# EAGLE design Power_POE (EAGLE 9.6.2)
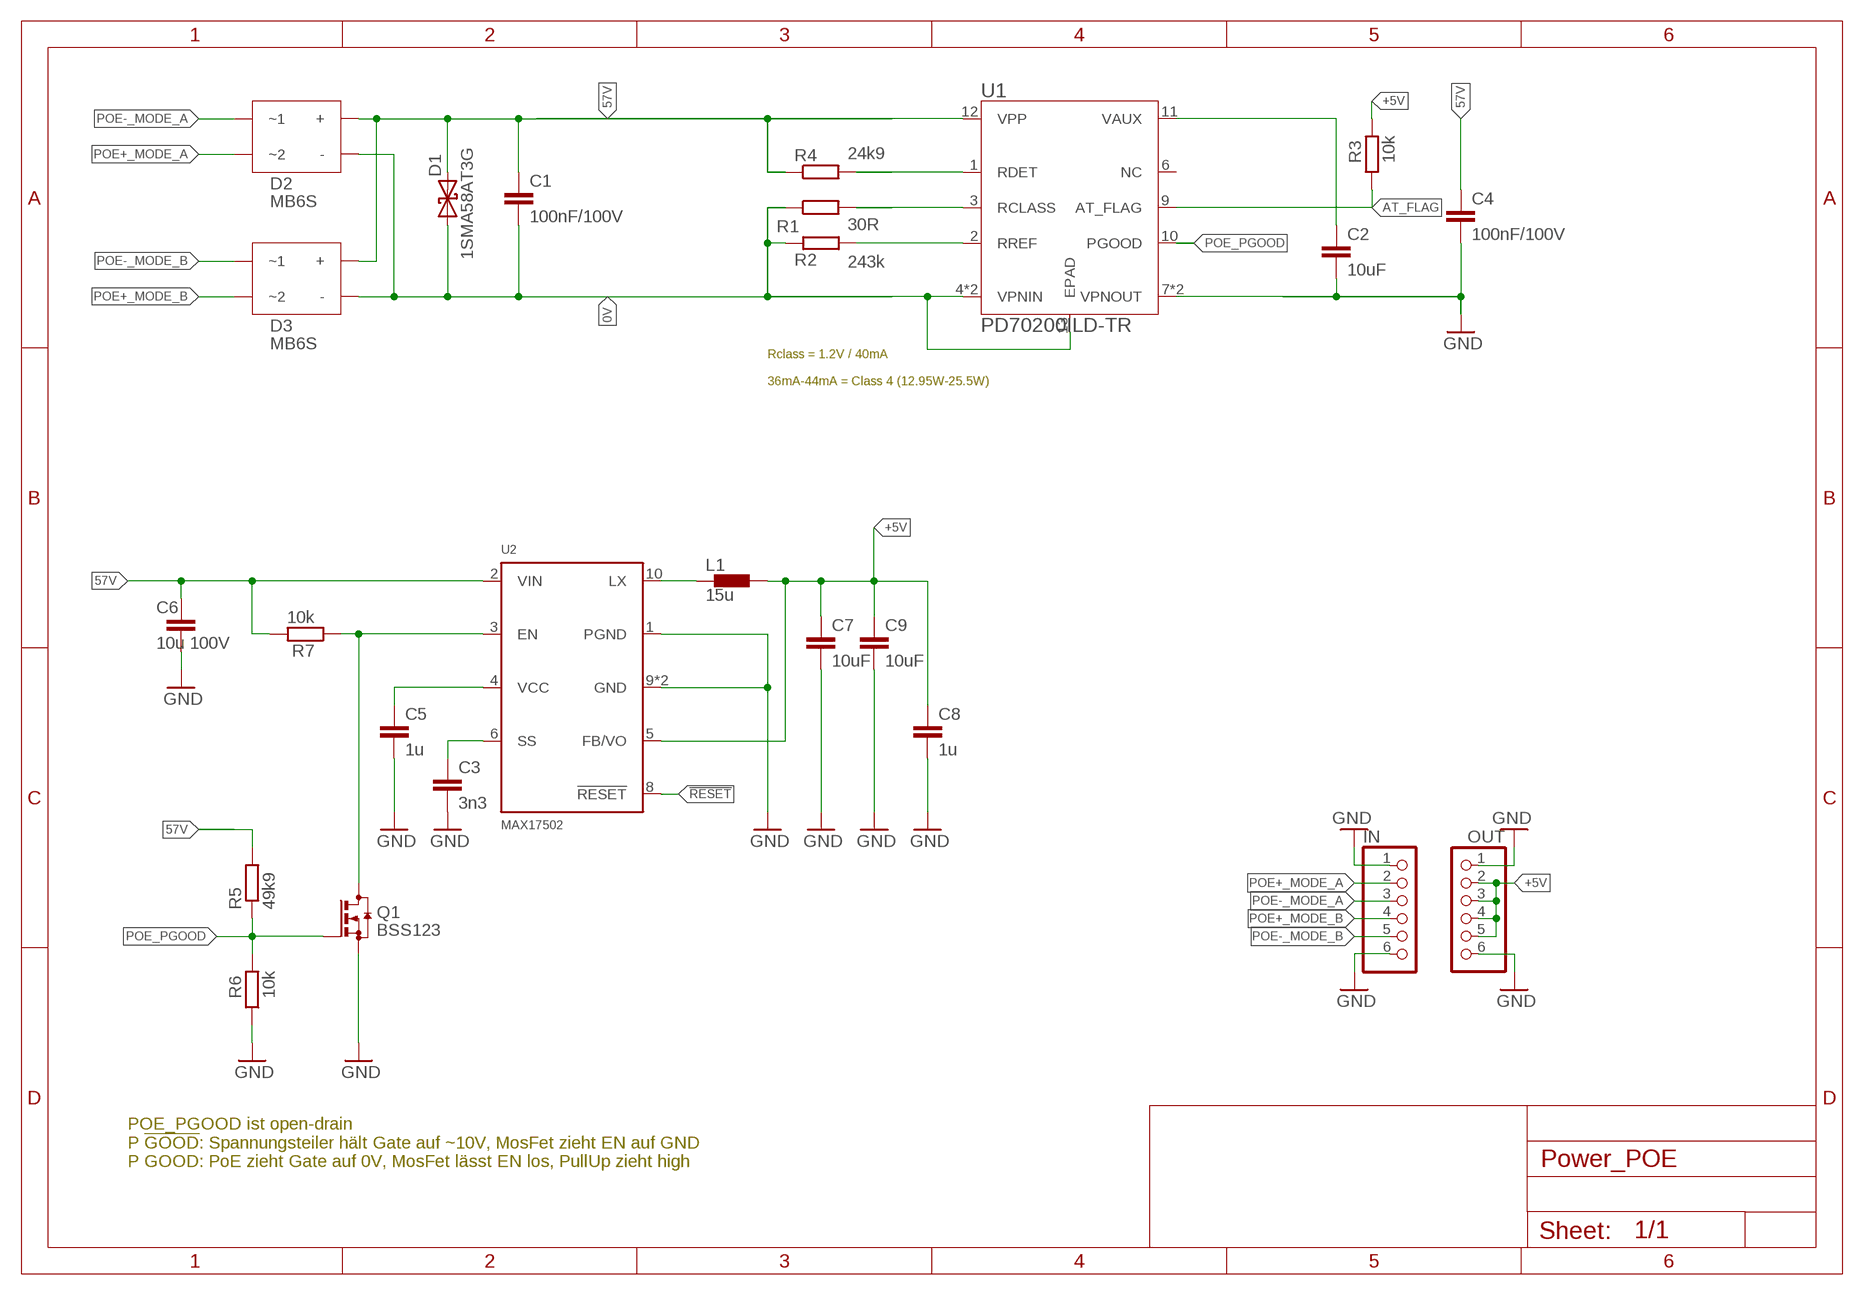
[diagram p0: schematic, sheet 1]

## Parts
C1  100nF/100V  C-EUC0603  [C0603]
C2  10uF  C-EUC0805  [C0805]
C3  3n3  C-EUC0603  [C0603]
C4  100nF/100V  C-EUC0603  [C0603]
C5  1u  C-EUC0805  [C0805]
C6  10u 100V  C-EUC1210K  [C1210K]
C7  10uF  C-EUC0805  [C0805]
C8  1u  C-EUC0805  [C0805]
C9  10uF  C-EUC0805  [C0805]
D1  1SMA58AT3G  SMAJ_DIODE  [DO214AC]
D2  MB6S  [SOIC4W]
D3  MB6S  [SOIC4W]
IN  PINHD-1X06_2.00  [1X06M]
L1  15u  INDUCTOR_LPS6235  [LPS6235]
OUT  PINHD-1X06_2.00  [1X06M]
Q1  BSS123  [SOT23]
R1  30R  R-EU_R0603  [R0603]
R2  243k  R-EU_R0603  [R0603]
R3  10k  R-EU_R0603  [R0603]
R4  24k9  R-EU_R0603  [R0603]
R5  49k9  R-EU_R0603  [R0603]
R6  10k  R-EU_R0603  [R0603]
R7  10k  R-EU_R0603  [R0603]
U1  PD70200ILD-TR  [DFN12_4X3_MIS]
U2  MAX17502  [TDFN10-3X2MM]

## Nets
0V: C1.2 D1.A D2.P$2(-) D3.P$2(-) R1.1 R2.1 U1.4(VPNIN) U1.5(VPNIN) U1.13(EPAD)
57V: C1.1 C4.1 C6.1 D1.C D2.P$1(+) D3.P$1(+) R4.1 R5.2 R7.2 U1.12(VPP) U2.2(VIN)
!RESET: U2.8(!RESET)
+5V: C7.1 C8.1 C9.1 L1.2 OUT.2 OUT.3 OUT.4 OUT.5 R3.2 U2.5(FB/VO)
AT_FLAG: R3.1 U1.9(AT_FLAG)
GND: C2.2 C3.2 C4.2 C5.2 C6.2 C7.2 C8.2 C9.2 IN.1 IN.6 OUT.1 OUT.6 Q1.2(S) R6.1 U1.7(VPNOUT) U1.8(VPNOUT) U2.1(PGND) U2.9(GND) U2.TH(GND)
N$00003: R4.2 U1.1(RDET)
N$00004: R1.2 U1.3(RCLASS)
N$00006: C5.1 U2.4(VCC)
N$00009: L1.1 U2.10(LX)
N$00011: R2.2 U1.2(RREF)
N$00020: C2.1 U1.11(VAUX)
N$00036: Q1.3(D) R7.1 U2.3(EN)
N$00043: C3.1 U2.6(SS)
POE+_MODE_A: D2.P$4(~2) IN.2
POE+_MODE_B: D3.P$4(~2) IN.4
POE-_MODE_A: D2.P$3(~1) IN.3
POE-_MODE_B: D3.P$3(~1) IN.5
POE_PGOOD: Q1.1(G) R5.1 R6.2 U1.10(PGOOD)
Unconnected: U1.6(NC)

## Notes on the sheet
- Rclass = 1.2V / 40mA
  
  36mA-44mA = Class 4 (12.95W-25.5W)
- POE_PGOOD ist open-drain
  P !GOOD!: Spannungsteiler hält Gate auf ~10V, MosFet zieht EN auf GND
  P GOOD: PoE zieht Gate auf 0V, MosFet lässt EN los, PullUp zieht high

## Library data of the parts
C1 C4 = rcl:C-EU: CAPACITOR, European symbol; DIGIKEY: 1276-6807-1-ND; LCSC: C15725; MBM: 1; PREIS: 0,09
C2 C7 C9 = rcl:C-EU: CAPACITOR, European symbol; LCSC: C3039694; PARAMETER: 10µF 25V X7R; SPICEPREFIX: C
C3 = rcl:C-EU: CAPACITOR, European symbol; BUERKLIN: 53D1704; LCSC: C1613; MBM: 10; PREIS: 0,083
C5 C8 = rcl:C-EU: CAPACITOR, European symbol; BUERKLIN: 53D2422; LAGERORT: 21/10; LCSC: C116352; MBM: 10; PREIS: 0,0952
C6 = rcl:C-EU: CAPACITOR, European symbol; DIGIKEY: 1276-CL32Y106KCVZNWECT-ND; LCSC: C576517; SPICEPREFIX: C
D1 = mh_fpga_anschlussplatine_v2:SMAJ_DIODE; DIGIKEY: SMAJ58ALFCT-ND; LCSC: C151246; MBM: 1; MF: Littlefuse; MPN: SMAJ58A; PARAMETER: 58V VRM, 64.4V VBR_MIN, 93.6V VBR_MAX; PREIS: 0,33
D2 D3 = MB6S:MB6S; LCSC: C83867; MOUSER: 512-MB6S
IN OUT = pinhead-2:PINHD-1X06: PIN HEADER
L1 = Coilcraft:INDUCTOR; DIGIKEY: 4652-LPS6235-153MRC-ND; LCSC: C3033031; MPN: LPS6235-153MRC; PREIS: 1,4
Q1 = transistor-small-signal:BSS123: N-CHANNEL MOS FET; DIGIKEY: 1727-4246-1-ND; LCSC: C79015
R1 = rcl:R-EU_: RESISTOR, European symbol; DIGIKEY: 738-RMCF0603FT30R0CT-ND; LCSC: C144119; SPICEPREFIX: R
R2 = rcl:R-EU_: RESISTOR, European symbol; DIGIKEY: RMCF0603FT243KCT-ND; LCSC: C23351; SPICEPREFIX: R
R3 R6 R7 = rcl:R-EU_: RESISTOR, European symbol; BUERKLIN: 26 E 816; LAGERORT: 45/08; LCSC: C25804; MBM: 10; PREIS: 0,03
R4 = rcl:R-EU_: RESISTOR, European symbol; FARNELL: 2447309; LCSC: C137761; SPICEPREFIX: R
R5 = rcl:R-EU_: RESISTOR, European symbol; DIGIKEY: RMCF0603FT49K9CT-ND; LCSC: C23184; SPICEPREFIX: R
U1 = TI_TPS2379:PD70200ILD-TR: IEEE® 802.3af/at PD Front End IC; DIGIKEY: PD70200ILDCT-ND; LCSC: C3187754
U2 = MAX17502:MAX17502: MAX17502 60V, 1A, Ultra-Small, High-Efficiency, Synchronous Step-Down DC-DC Converter; DIGIKEY: MAX17502EATB+TCT-ND; LCSC: C571005; MPN: MAX17502EATB+T; PREIS: 4,92

## Net classes
0 default: width 0.15 mm, drill 0.3 mm
1 diff_pair: width 0.15 mm, drill 0.3 mm
2 diff: width 0.125 mm, drill 0.2 mm, clearance 0.125 mm

## Board
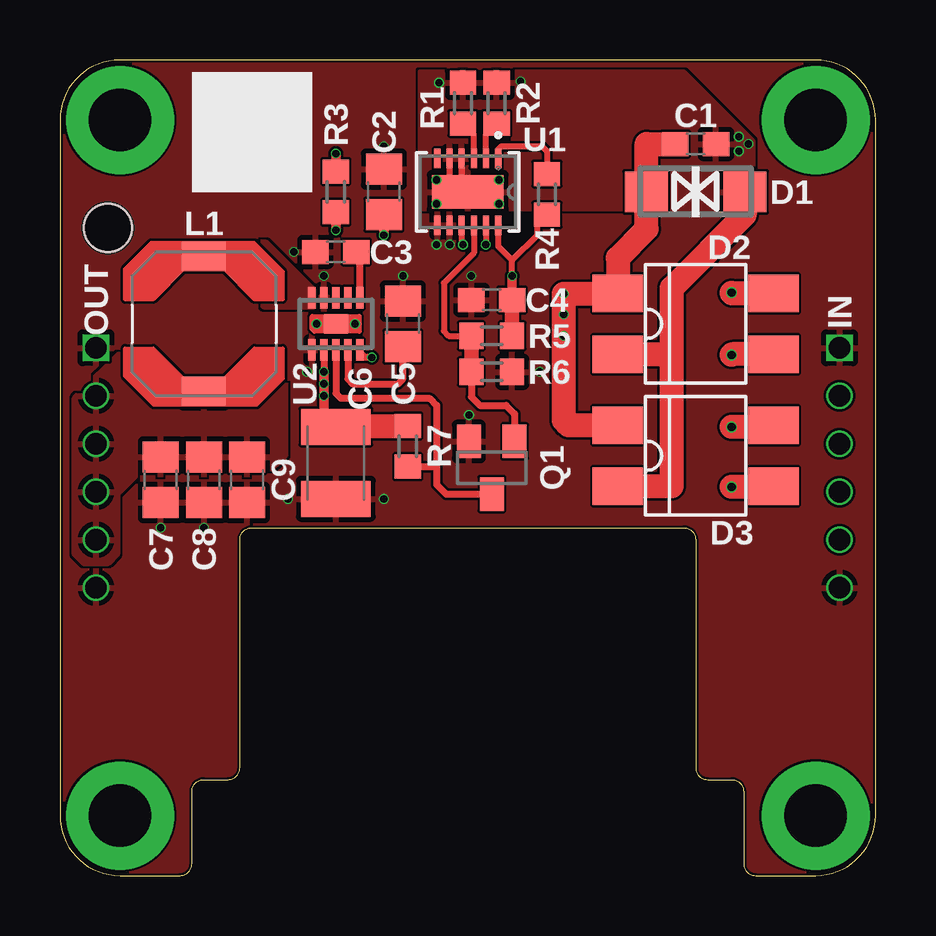
[diagram p1: board, top side]
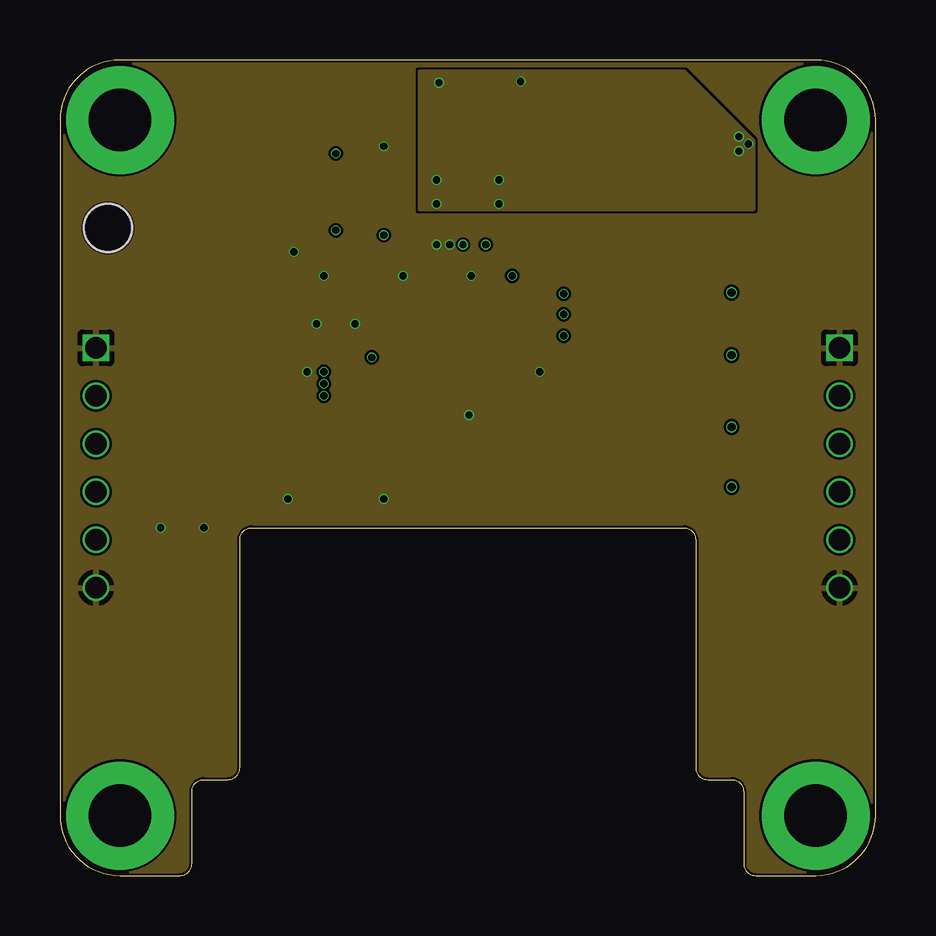
[diagram p2: board, inner layer Route2]
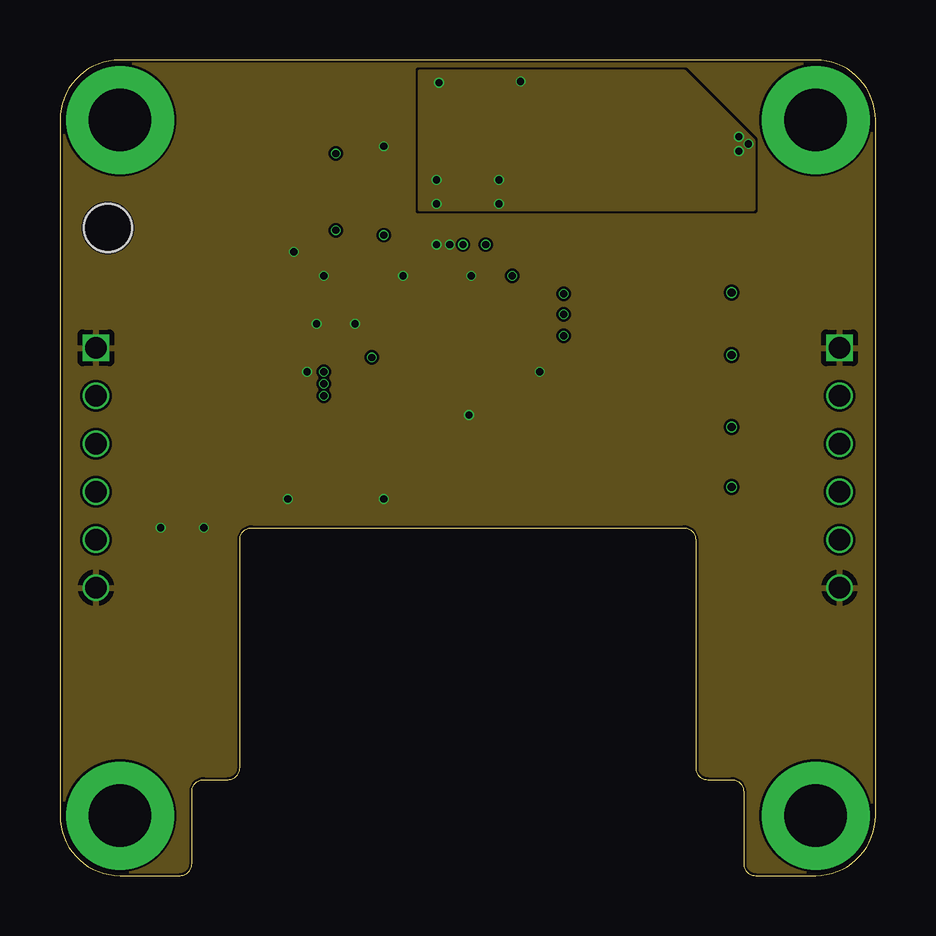
[diagram p3: board, inner layer Route15]
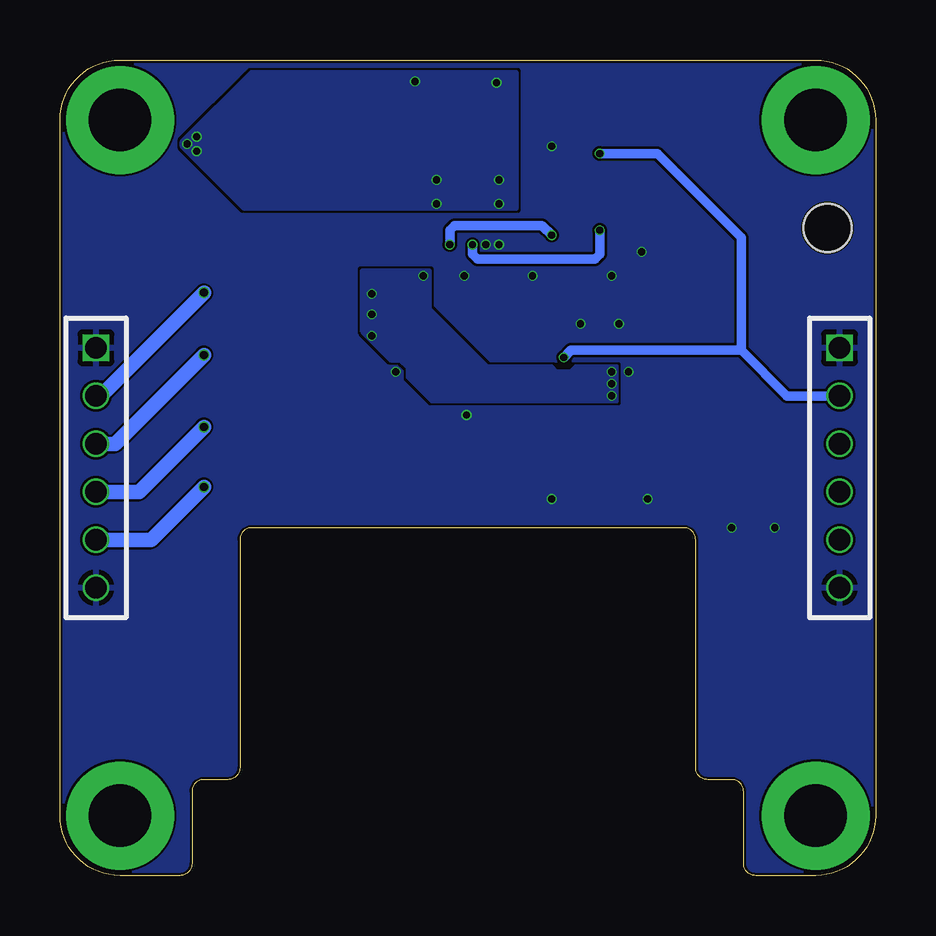
[diagram p4: board, bottom side, seen from below]

Size 34 x 34 mm. Coordinates in mm from the lower left corner, seen from the top.
Outline: 0,31.5 0,2.5 arc90 2.5,0 5,0 arc90 5.5,0.5 5.5,3.5 arc-90 6,4 7,4 arc90 7.5,4.5 7.5,14 arc-90 8,14.5 26,14.5 arc-90 26.5,14 26.5,4.5 arc90 27,4 28,4 arc-90 28.5,3.5 28.5,0.5 arc90 29,0 31.5,0 arc90 34,2.5 34,31.5 arc90 31.5,34 2.5,34 arc90 0,31.5
Copper layers (1+2*15+16): Top 0.035559375mm / dielectric 0.17018125mm / Route2 0.01778125mm / dielectric 47mil / Route15 0.01778125mm / dielectric 0.17018125mm / Bottom 0.035559375mm
Design rules "jlcpcb-6-layer *": minimum track width 0.1mm, minimum drill 0.3mm, track to track 0.1mm, track to pad 5mil, pad to pad 5mil, via to via 5mil, smd to smd 0mil, copper to edge 0.1mm, drill to drill 5mil, minimum pad ring 4mil, minimum via ring 0.05mm, stop-mask expansion 3mil, vias tented up to drill 100mil, thermal gap 8mil
Holes 2 mm at 2,27

### Footprints (pad centres in the part's own frame; a part is rotated, then mirrored left to right if it is on the bottom)
C0603 = smd 1.1 x 1: 1 -0.85,0; 2 0.85,0
C0805 = smd 1.3 x 1.5: 1 -0.95,0; 2 0.95,0
C1210K = smd 1.5 x 2.9: 1 -1.5,0; 2 1.5,0
DO214AC = smd 1.8 x 1.7: A 2.05,0; C -2.05,0
SOIC4W = smd 1.55 x 2.1: P$1 -1.27,-3.25; P$2 1.27,-3.25; P$3 1.27,3.25; P$4 -1.27,3.25
1X06M = drill 0.914 square: 1 -5,0 | drill 0.914: 2 -3,0; 3 -1,0; 4 1,0; 5 3,0; 6 5,0
LPS6235 = smd 1.2 x 1.8: 1 -2.8,0; 2 2.8,0
SOT23 = smd 1 x 1.4: 1 -0.95,-1.1; 2 0.95,-1.1; 3 0,1.1
R0603 = smd 1 x 1.1: 1 -0.85,0; 2 0.85,0
DFN12_4X3_MIS = smd 0.808 x 0.255: 1 -1.395,1.27; 2 -1.395,0.762; 3 -1.395,0.254; 4 -1.395,-0.254; 5 -1.395,-0.762; 6 -1.395,-1.27; 7 1.395,-1.27; 8 1.395,-0.762; 9 1.395,-0.254; 10 1.395,0.254; 11 1.395,0.762; 12 1.395,1.27 | smd 1.397 x 2.997: 13 0,0
TDFN10-3X2MM = smd 0.9 x 0.3: 1 -1.09,1; 2 -1.09,0.5; 3 -1.09,0; 4 -1.09,-0.5; 5 -1.09,-1; 6 1.09,-1; 7 1.09,-0.5; 8 1.09,0; 9 1.09,0.5; 10 1.09,1 | smd 0.8 x 1: TH 0,0

### Placement (x,y rotation side)
C1  26.5,30.5 0 top
C2  13.5,28.5 90 top
C3  11.5,26 180 top
C4  18,24 180 top
C5  14.3,23 90 top
C6  11.5,17.2 270 top
C7  4.2,16.5 270 top
C8  6,16.5 270 top
C9  7.8,16.5 270 top
D1  26.5,28.5 0 top
D2  26.5,23 270 top
D3  26.5,17.5 270 top
IN  32.5,17 270 bottom
L1  6,23 270 top
OUT  1.5,17 270 bottom
Q1  18,17 180 top
R1  16.8,32.2 270 top
R2  18.2,32.2 270 top
R3  11.5,28.5 90 top
R4  20.3,28.4 90 top
R5  18,22.5 0 top
R6  18,21 180 top
R7  14.5,17.9 90 top
U1  17,28.5 270 top
U2  11.5,23 90 top

### Tracks (layer width: path | path; a pad name or v marks a point on that pad's centre or on a via)
0V  (via drill 0.3)
  Top 0.25: U1.5 16.24,28.96 16.6,28.6 | U1.4 16.75,28.75 16.6,28.6 | 16.6,28.6 16.7,28.5 U1.13 17.8,28.5 v18.3,28
  Top 1: D3.P$2 25.5,16.23 25.5,21.73 | D2.P$2 25.5,21.73 | 25.5,21.73 25.5,24.5 28.55,27.55 D1.A 28.62,28.57
  other vias: 15.8,33.05 15.7,29 28.3,30.8 28.3,30.2 28.7,30.5 15.7,28 18.3,29 19.2,33.1
  pour Bottom: 15,27.8 26.3,27.8 28.9,30.4 28.9,30.6 26,33.5 15,33.5
  pour Top: 15,27.8 28.9,27.8 28.9,30.6 26,33.5 15,33.5
  pour Route2: 15,27.8 28.9,27.8 28.9,30.6 26,33.5 15,33.5
  pour Route15: 15,27.8 28.9,27.8 28.9,30.6 26,33.5 15,33.5
57V  (via drill 0.3)
  Top 0.25: U1.12 18.27,26.23 18.85,25.65 | v18.85,25 18.85,25.65 | R4.1 19.95,27.55 19.9,27.5 19.9,26.7 18.85,25.65
  Top 0.3: U2.2 v11,21 | 11,19.2 C6.1
  Top 0.4: v11,21 v11,20.5 v11,20 11,19.2 | C4.1 v18.85,25
  Top 0.6: R5.2 C4.1
  Top 1: D3.P$1 21.2,18.77 21,18.97 v21,22.5 v21,23.4 v21,24.25 23.23,24.25 D2.P$1 23.25,25.75 24.45,26.95 D1.C 24.45,30.5 C1.1 | C6.1 11.55,18.75 R7.2
  pour Bottom: 10.8,21.2 12.5,21.2 12.7,21 13.3,21 13.5,21.2 16.2,21.2 18.6,23.6 18.6,25.2 21.4,25.2 21.4,22.7 20.2,21.5 19.8,21.5 19.5,21.2 19.5,20.8 18.5,19.8 10.8,19.8
+5V  (via drill 0.3)
  Top 0.3: U2.5 12.5,21.81 12.71,21.6 v13,21.6
  Top 0.4: R3.2 v11.5,30.1
  Top 1: 7,20.2 L1.2 5,20.2
  Bottom 0.4: v13,21.6 12.7,21.9 5.6,21.9 | 5.6,21.9 3.7,20 OUT.2 | 5.6,21.9 5.6,26.6 9.1,30.1 v11.5,30.1
  pour Top: 0.6,19.9 2.7,22 3.8,22 5.1,20.7 6.8,20.7 8.1,22 9.4,22 9.4,17.5 8.6,16.7 3.2,16.7 2.4,15.9 2.4,13.4 2,13 1,13 0.6,13.4
AT_FLAG  (via drill 0.3)
  Top 0.25: U1.9 16.75,26.35 v16.8,26.3 | 11.65,27.65 R3.1
  Top 0.4: R3.1 v11.5,26.9
  Bottom 0.4: v16.8,26.3 16.8,25.9 16.6,25.7 11.7,25.7 11.5,25.9 v11.5,26.9
GND  (via drill 0.3)
  other vias: 16.25,26.3 15.7,26.3 17.15,25 20,21 4.2,14.5 6,14.5 9.5,15.7 13.5,15.7 17.05,19.2 10.7,23 12.3,23 9.75,26 14.3,25 13.5,30.4 11,25 10.3,21
  pour Route2 (rank 2): 0,0 34,0 34,34 0,34
  pour Top (rank 2): 0,0 34,0 34,34 0,34
  pour Bottom (rank 3): 0,0 34,0 34,34 0,34
  pour Route15 (rank 2): 0,0 34,0 34,34 0,34
N$00001  (via drill 2.6 pad 4.5)
  other vias: 31.5,31.5
N$00002  (via drill 2.6 pad 4.5)
  other vias: 2.5,31.5
N$00003
  Top 0.25: U1.1 18.27,30.27 18.4,30.4 20.1,30.4 20.3,30.2 R4.2
N$00004
  Top 0.25: U1.3 17.25,30.9 R1.2
N$00006
  Top 0.3: U2.4 12,20.7 12.2,20.5 14.1,20.5 14.3,20.7 C5.1
N$00007  (via drill 2.6 pad 4.5)
  other vias: 2.5,2.5
N$00008  (via drill 2.6 pad 4.5)
  other vias: 31.5,2.5
N$00009
  pour Top (no thermals): 10.6,23.7 10.6,24.4 8.6,26.4 5.4,26.4 5.4,25.3 6.9,25.3 8.5,23.7
N$00011
  Top 0.25: U1.2 17.76,30.91 R2.2
N$00020  (via drill 0.3)
  Top 0.25: U1.11 17.76,26.31 v17.75,26.3
  Top 0.4: C2.1 v13.5,26.7
  Bottom 0.4: v17.75,26.3 17.75,26.9 17.55,27.1 13.9,27.1 v13.5,26.7
N$00036
  Top 0.3: U2.3 11.5,20.1 11.7,19.9 15.4,19.9 15.7,19.6 15.7,17 | Q1.3 16.1,15.9 15.7,16.3 15.7,17 | R7.1 15.65,17.05 15.7,17
N$00043
  Top 0.3: U2.6 12.5,25.85 C3.1
POE+_MODE_A  (via drill 0.35)
  Top 1: D2.P$4 28.03,24.27 v28,24.3
  Bottom 0.6: IN.2 32.3,20 v28,24.3
POE+_MODE_B  (via drill 0.35)
  Top 1: D3.P$4 29.68,18.7 v28,18.7
  Bottom 0.6: IN.4 30.7,16 v28,18.7
POE-_MODE_A  (via drill 0.35)
  Top 1: D2.P$3 28.03,21.73 v28,21.7
  Bottom 0.6: IN.3 31.7,18 v28,21.7
POE-_MODE_B  (via drill 0.35)
  Top 1: D3.P$3 29.72,16.2 v28,16.2
  Bottom 0.6: IN.5 30.2,14 v28,16.2
POE_PGOOD
  Top 0.25: U1.10 17.25,25.95 16,24.7 16,22.7 16.2,22.5 R5.1
  Top 0.3: R6.2 17.15,19.95 17.5,19.6 18.6,19.6 18.95,19.25 Q1.1
  Top 0.6: R6.2 R5.1

### Text on the board
tStop: PoE